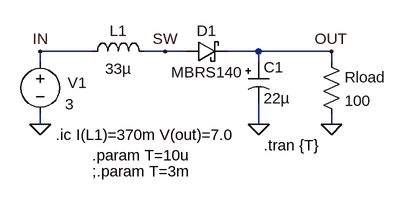
[diagram p0: schematic StepUpRevers.asc]
StepUpRevers.asc, the LTspice schematic file:
Version 4
SHEET 1 2376 1416
WIRE 1568 944 1488 944
WIRE 1680 944 1648 944
WIRE 1712 944 1680 944
WIRE 1824 944 1776 944
WIRE 1936 944 1824 944
WIRE 1488 960 1488 944
WIRE 1824 960 1824 944
WIRE 1936 960 1936 944
WIRE 1488 1056 1488 1040
WIRE 1824 1056 1824 1024
WIRE 1936 1056 1936 1040
FLAG 1936 944 OUT
FLAG 1824 1056 0
FLAG 1936 1056 0
FLAG 1488 1056 0
FLAG 1488 944 IN
FLAG 1680 944 SW
SYMBOL VOLTAGE 1488 944 R0
WINDOW 123 0 0 Left 0
WINDOW 0 42 48 Left 0
WINDOW 3 38 81 Left 0
SYMATTR InstName V1
SYMATTR Value 3
SYMATTR SpiceLine Rser=0.1
SYMBOL POLCAP 1808 960 R0
SYMATTR InstName C1
SYMATTR Value 22µ
SYMATTR SpiceLine Rser=0.02
SYMBOL schottky 1712 960 R270
WINDOW 0 32 32 VTop 0
WINDOW 3 0 32 VBottom 0
SYMATTR InstName D1
SYMATTR Value MBRS140
SYMBOL IND 1552 960 R270
WINDOW 0 32 56 VTop 0
WINDOW 3 5 56 VBottom 0
SYMATTR InstName L1
SYMATTR Value 33µ
SYMATTR SpiceLine Rser=0.02 Rpar=5000
SYMBOL res 1920 944 R0
SYMATTR InstName Rload
SYMATTR Value 100
TEXT 1832 1088 Left 0 !.tran {T}
TEXT 1512 1072 Left 0 !.ic I(L1)=370m V(out)=7.0
TEXT 1568 1128 Left 0 !;.param T=3m
TEXT 1568 1104 Left 0 !.param T=10u

The netlist it stands for:
* StepUpRevers.asc
V1 IN 0 3 Rser=0.1
C1 OUT 0 22µ Rser=0.02
D1 SW OUT MBRS140
L1 IN SW 33µ Rser=0.02 Rpar=5000
Rload OUT 0 100
.model D D
.lib standard.dio
.tran {T}
.ic I(L1)=370m V(out)=7.0
;.param T=3m
.param T=10u
.backanno
.end